# EAGLE schematic 5x4 Macropad (EAGLE 9.7.0)
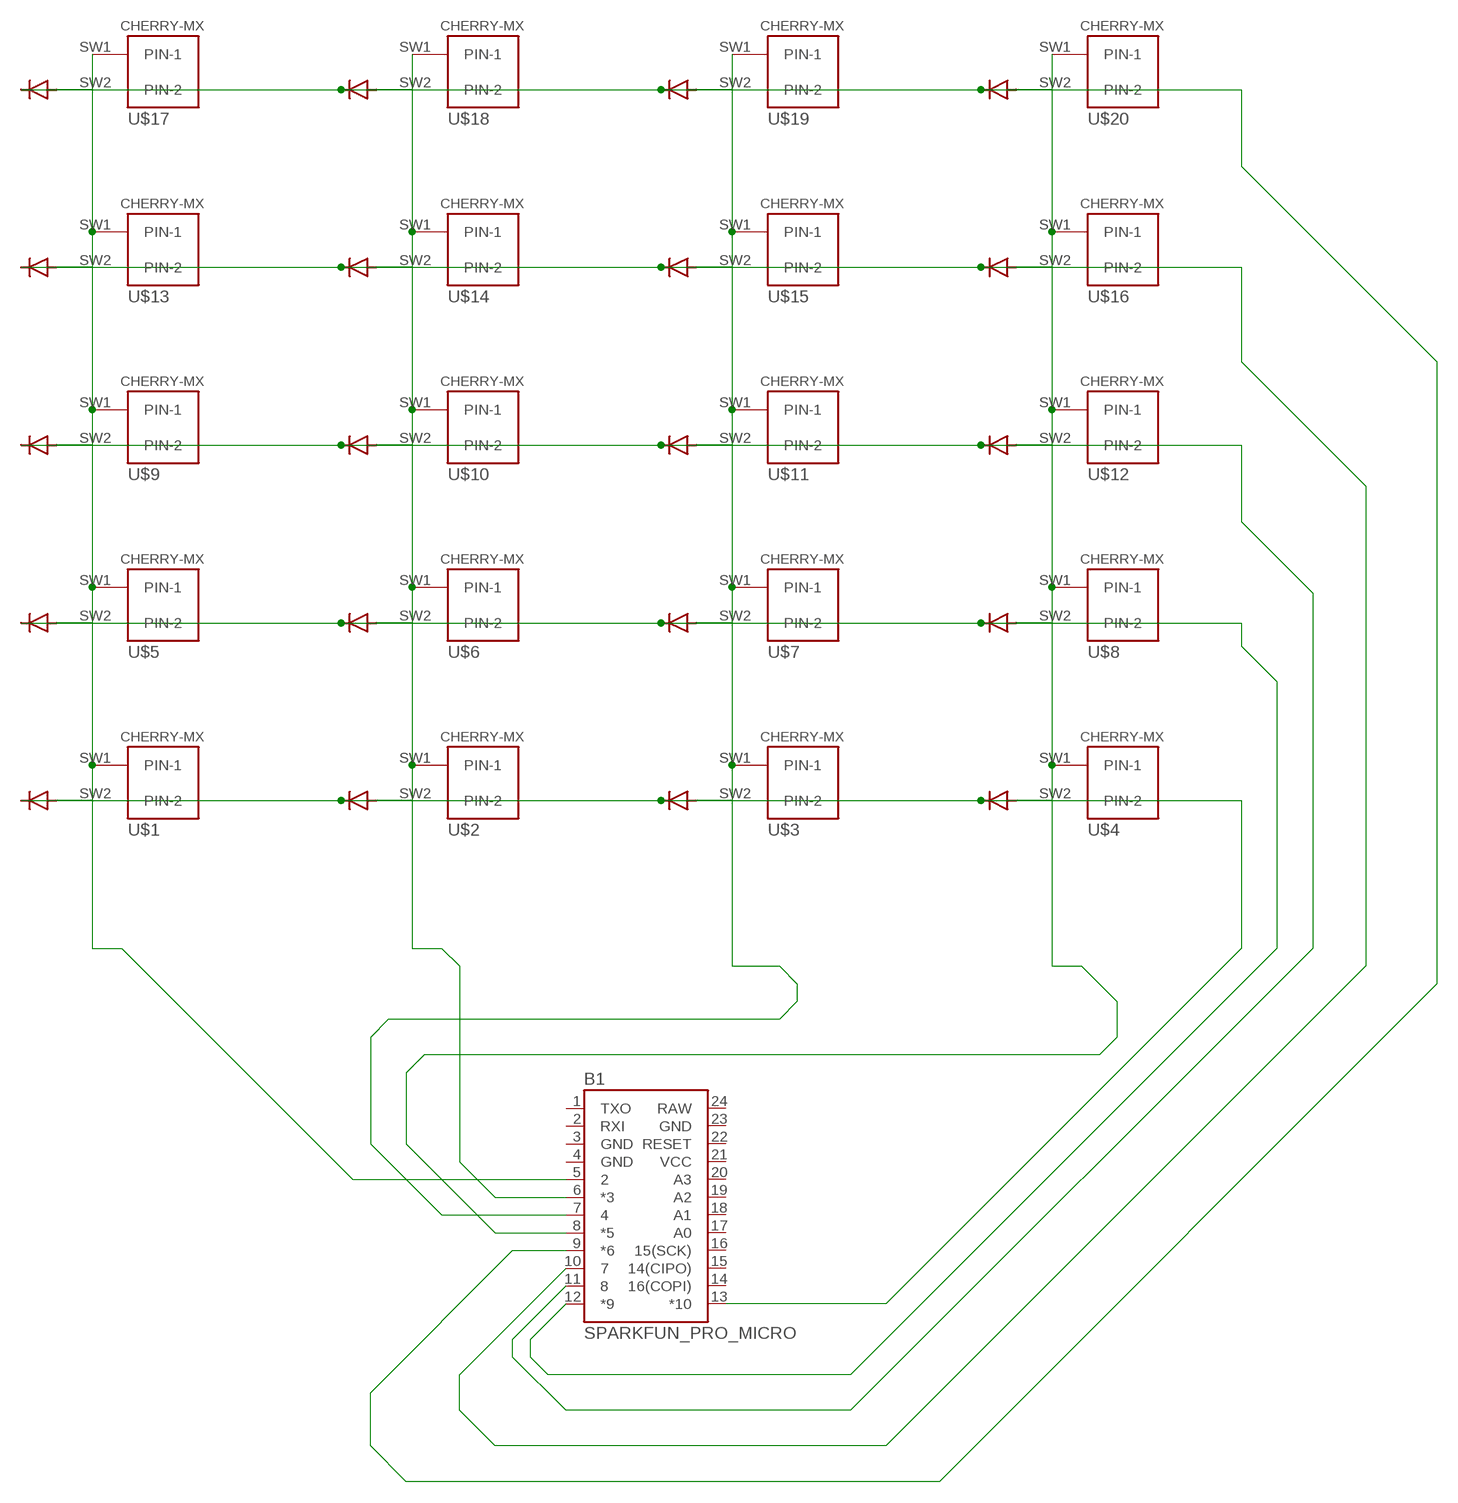
[diagram p0: schematic, sheet 1]

## Parts
B1  SPARKFUN_PRO_MICRO  [SPARKFUN_PRO_MICRO]
D1  1N4148DO35-10  [DO35-10]
D2  1N4148DO35-10  [DO35-10]
D3  1N4148DO35-10  [DO35-10]
D4  1N4148DO35-10  [DO35-10]
D5  1N4148DO35-10  [DO35-10]
D6  1N4148DO35-10  [DO35-10]
D7  1N4148DO35-10  [DO35-10]
D8  1N4148DO35-10  [DO35-10]
D9  1N4148DO35-10  [DO35-10]
D10  1N4148DO35-10  [DO35-10]
D11  1N4148DO35-10  [DO35-10]
D12  1N4148DO35-10  [DO35-10]
D13  1N4148DO35-10  [DO35-10]
D14  1N4148DO35-10  [DO35-10]
D15  1N4148DO35-10  [DO35-10]
D16  1N4148DO35-10  [DO35-10]
D17  1N4148DO35-10  [DO35-10]
D18  1N4148DO35-10  [DO35-10]
D19  1N4148DO35-10  [DO35-10]
D20  1N4148DO35-10  [DO35-10]
U$1  CHERRY-MX  [CHERRY-MX]
U$2  CHERRY-MX  [CHERRY-MX]
U$3  CHERRY-MX  [CHERRY-MX]
U$4  CHERRY-MX  [CHERRY-MX]
U$5  CHERRY-MX  [CHERRY-MX]
U$6  CHERRY-MX  [CHERRY-MX]
U$7  CHERRY-MX  [CHERRY-MX]
U$8  CHERRY-MX  [CHERRY-MX]
U$9  CHERRY-MX  [CHERRY-MX]
U$10  CHERRY-MX  [CHERRY-MX]
U$11  CHERRY-MX  [CHERRY-MX]
U$12  CHERRY-MX  [CHERRY-MX]
U$13  CHERRY-MX  [CHERRY-MX]
U$14  CHERRY-MX  [CHERRY-MX]
U$15  CHERRY-MX  [CHERRY-MX]
U$16  CHERRY-MX  [CHERRY-MX]
U$17  CHERRY-MX  [CHERRY-MX]
U$18  CHERRY-MX  [CHERRY-MX]
U$19  CHERRY-MX  [CHERRY-MX]
U$20  CHERRY-MX  [CHERRY-MX]

## Nets
N$1: D1.A U$1.SW2(PIN-2)
N$2: D2.A U$2.SW2(PIN-2)
N$3: D3.A U$3.SW2(PIN-2)
N$4: D4.A U$4.SW2(PIN-2)
N$5: D5.A U$5.SW2(PIN-2)
N$6: D6.A U$6.SW2(PIN-2)
N$7: D7.A U$7.SW2(PIN-2)
N$8: D8.A U$8.SW2(PIN-2)
N$9: D9.A U$9.SW2(PIN-2)
N$10: D10.A U$10.SW2(PIN-2)
N$11: D11.A U$11.SW2(PIN-2)
N$12: D12.A U$12.SW2(PIN-2)
N$13: D13.A U$13.SW2(PIN-2)
N$14: D14.A U$14.SW2(PIN-2)
N$15: D15.A U$15.SW2(PIN-2)
N$16: D16.A U$16.SW2(PIN-2)
N$17: D17.A U$17.SW2(PIN-2)
N$18: D18.A U$18.SW2(PIN-2)
N$19: D19.A U$19.SW2(PIN-2)
N$20: D20.A U$20.SW2(PIN-2)
N$21: B1.8(*5) U$4.SW1(PIN-1) U$8.SW1(PIN-1) U$12.SW1(PIN-1) U$16.SW1(PIN-1) U$20.SW1(PIN-1)
N$22: B1.7 U$3.SW1(PIN-1) U$7.SW1(PIN-1) U$11.SW1(PIN-1) U$15.SW1(PIN-1) U$19.SW1(PIN-1)
N$23: B1.6(*3) U$2.SW1(PIN-1) U$6.SW1(PIN-1) U$10.SW1(PIN-1) U$14.SW1(PIN-1) U$18.SW1(PIN-1)
N$24: B1.5 U$1.SW1(PIN-1) U$5.SW1(PIN-1) U$9.SW1(PIN-1) U$13.SW1(PIN-1) U$17.SW1(PIN-1)
N$25: B1.9(*6) D17.C D18.C D19.C D20.C
N$26: B1.10 D13.C D14.C D15.C D16.C
N$27: B1.11 D9.C D10.C D11.C D12.C
N$28: B1.12(*9) D5.C D6.C D7.C D8.C
N$29: B1.13(*10) D1.C D2.C D3.C D4.C
Unconnected: B1.1(TXO) B1.2(RXI) B1.14(16(COPI)) B1.15(14(CIPO)) B1.16(15(SCK)) B1.17(A0) B1.18(A1) B1.19(A2) B1.20(A3) B1.22(RESET)

## Power pins joined to a net without a drawn wire
GND: B1.3(GND) B1.4(GND) B1.23(GND)
RAW: B1.24(RAW)
VCC: B1.21(VCC)

## Library data of the parts
B1 = SparkFun-Boards:SPARKFUN_PRO_MICRO: SparkFun Pro Micro Atmega32U4 compatible footprint. SparkFun Products: 3.3V/8MHz <https://www.sparkfun.com/products/12587> 5V/16MHz <https://www.sparkfun.com/products/12640>
D1-D20 = diode:1N4148: DIODE high speed (Philips)
U$1-U$20 = cherrymx:CHERRY-MX: Cherry MX series keyswitch